# EAGLE design volume control (EAGLE 6.4)
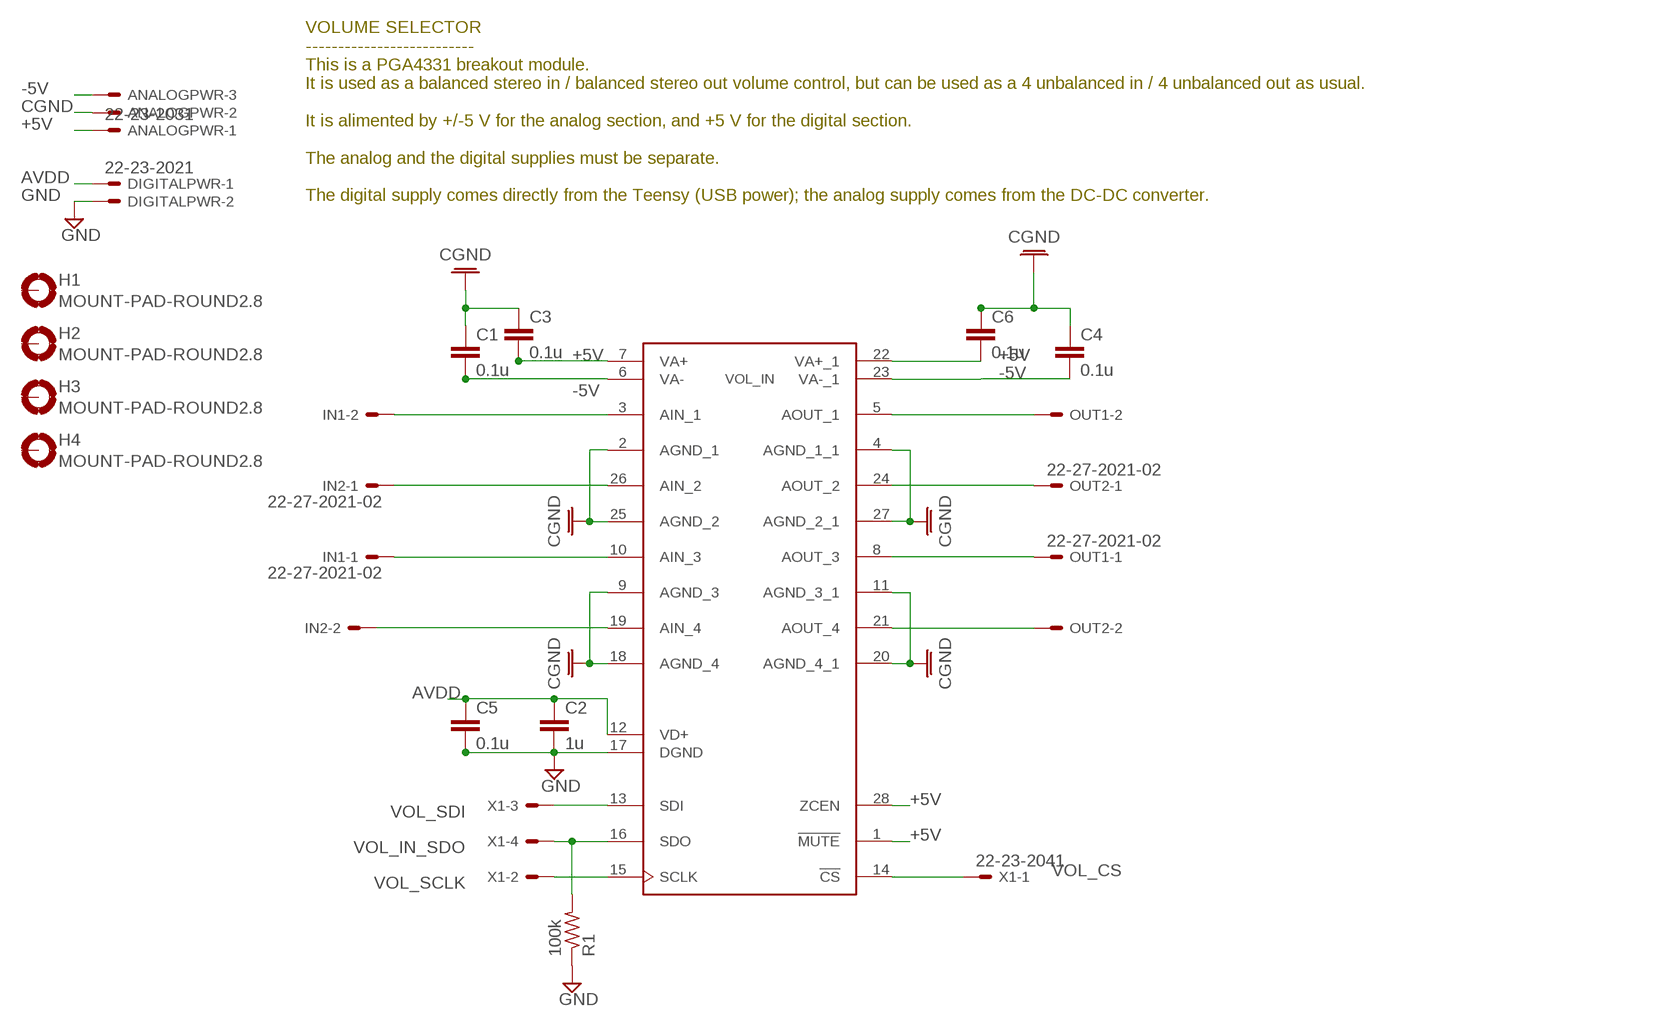
[diagram p0: schematic, sheet 1]

## Parts
ANALOGPWR  22-23-2031  [22-23-2031]
C1  0.1u  C-EUC0603  [C0603]
C2  1u  C-EUC0603  [C0603]
C3  0.1u  C-EUC0603  [C0603]
C4  0.1u  C-EUC0603  [C0603]
C5  0.1u  C-EUC0603  [C0603]
C6  0.1u  C-EUC0603  [C0603]
DIGITALPWR  22-23-2021  [22-23-2021]
H1  MOUNT-PAD-ROUND2.8  [2,8-PAD]
H2  MOUNT-PAD-ROUND2.8  [2,8-PAD]
H3  MOUNT-PAD-ROUND2.8  [2,8-PAD]
H4  MOUNT-PAD-ROUND2.8  [2,8-PAD]
IN1  22-27-2021-02  [6410-02]
IN2  22-27-2021-02  [6410-02]
OUT1  22-27-2021-02  [6410-02]
OUT2  22-27-2021-02  [6410-02]
R1  100k  R-US_R0603  [R0603]
VOL_IN  PGA4311  [DW_R-PDSO_G28]
X1  22-23-2041  [22-23-2041]

## Nets
+5V: ANALOGPWR.1 C3.2 C6.2 VOL_IN.1(!MUTE) VOL_IN.7(VA+) VOL_IN.22(VA+_1) VOL_IN.28(ZCEN)
-5V: ANALOGPWR.3 C1.2 C4.2 VOL_IN.6(VA-) VOL_IN.23(VA-_1)
AVDD: C2.1 C5.1 DIGITALPWR.1 VOL_IN.12(VD+)
CGND: ANALOGPWR.2 C1.1 C3.1 C4.1 C6.1 VOL_IN.2(AGND_1) VOL_IN.4(AGND_1_1) VOL_IN.9(AGND_3) VOL_IN.11(AGND_3_1) VOL_IN.18(AGND_4) VOL_IN.20(AGND_4_1) VOL_IN.25(AGND_2) VOL_IN.27(AGND_2_1)
GND: C2.2 C5.2 DIGITALPWR.2 R1.1 VOL_IN.17(DGND)
N$1: OUT1.1 VOL_IN.8(AOUT_3)
N$2: IN1.2 VOL_IN.3(AIN_1)
N$3: IN1.1 VOL_IN.10(AIN_3)
N$4: OUT2.1 VOL_IN.24(AOUT_2)
N$28: OUT1.2 VOL_IN.5(AOUT_1)
N$47: OUT2.2 VOL_IN.21(AOUT_4)
N$57: IN2.1 VOL_IN.26(AIN_2)
N$80: IN2.2 VOL_IN.19(AIN_4)
VOL_CS: VOL_IN.14(!CS) X1.1
VOL_IN_SDO: R1.2 VOL_IN.16(SDO) X1.4
VOL_SCLK: VOL_IN.15(SCLK) X1.2
VOL_SDI: VOL_IN.13(SDI) X1.3
Unconnected: H1.B2,8(MOUNT) H2.B2,8(MOUNT) H3.B2,8(MOUNT) H4.B2,8(MOUNT)

## Notes on the sheet
- VOLUME SELECTOR
  --------------------------
  This is a PGA4331 breakout module.
  It is used as a balanced stereo in / balanced stereo out volume control, but can be used as a 4 unbalanced in / 4 unbalanced out as usual.
  
  It is alimented by +/-5 V for the analog section, and +5 V for the digital section.
  
  The analog and the digital supplies must be separate.
  
  The digital supply comes directly from the Teensy (USB power); the analog supply comes from the DC-DC converter.

## Library data of the parts
ANALOGPWR = con-molex:22-23-2031: .100" (2.54mm) Center Header - 3 Pin; MF: MOLEX; MPN: 22-23-2031; OC_FARNELL: 1462950; OC_NEWARK: 30C0862
C1-C6 = rcl:C-EU: CAPACITOR, European symbol
DIGITALPWR = con-molex:22-23-2021: .100" (2.54mm) Center Header - 2 Pin; MF: MOLEX; MPN: 22-23-2021; OC_FARNELL: 1462926; OC_NEWARK: 25C3832
H1-H4 = holes:MOUNT-PAD-ROUND: MOUNTING PAD, round
IN1 IN2 OUT1 OUT2 = con-molex:22-?-02: CONNECTOR wire to board 2.54 mm (.1 inch) pitch header; OC_FARNELL: unknown; OC_NEWARK: unknown
R1 = resistor:R-US_: RESISTOR, American symbol
VOL_IN = texas:PGA4311
X1 = con-molex:22-23-2041: .100" (2.54mm) Center Header - 4 Pin; MF: MOLEX; MPN: 22-23-2041; OC_FARNELL: 1462920; OC_NEWARK: 38C0355

## Board
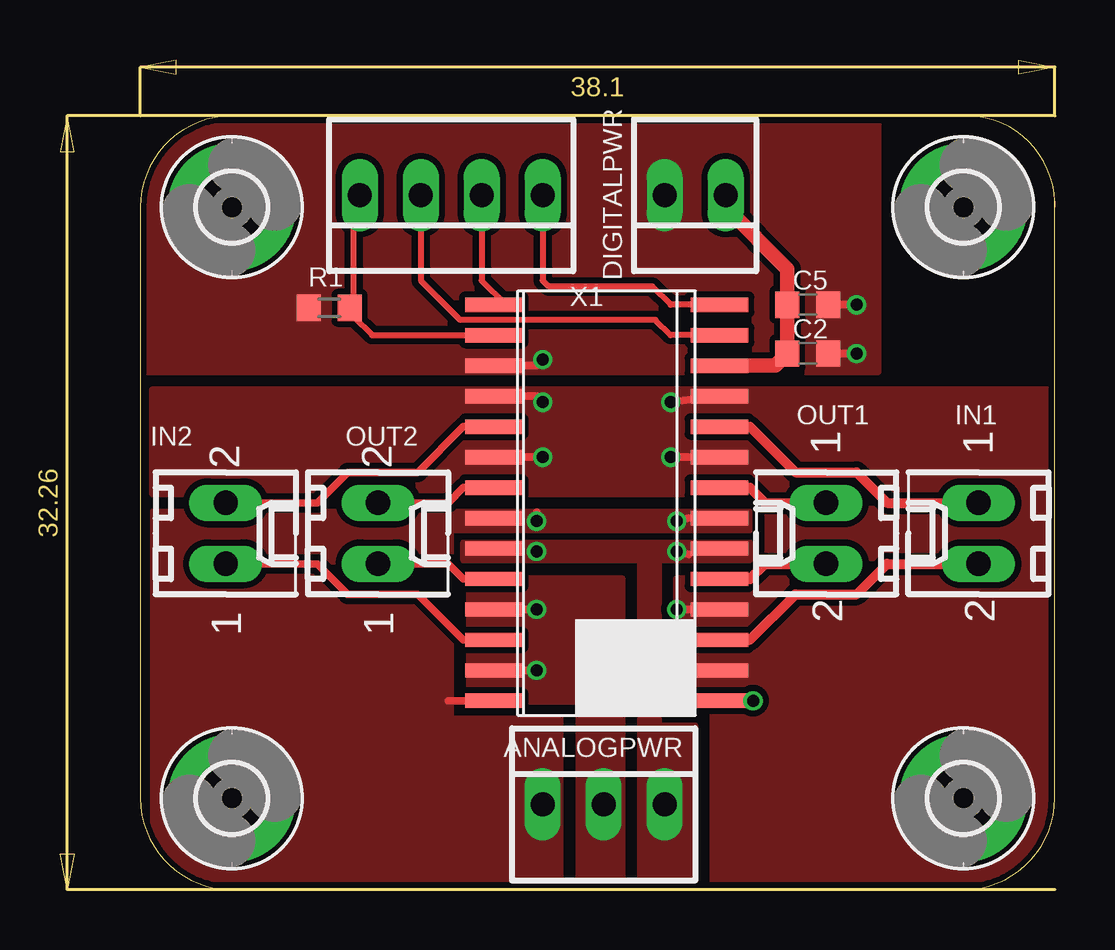
[diagram p1: board, top side]
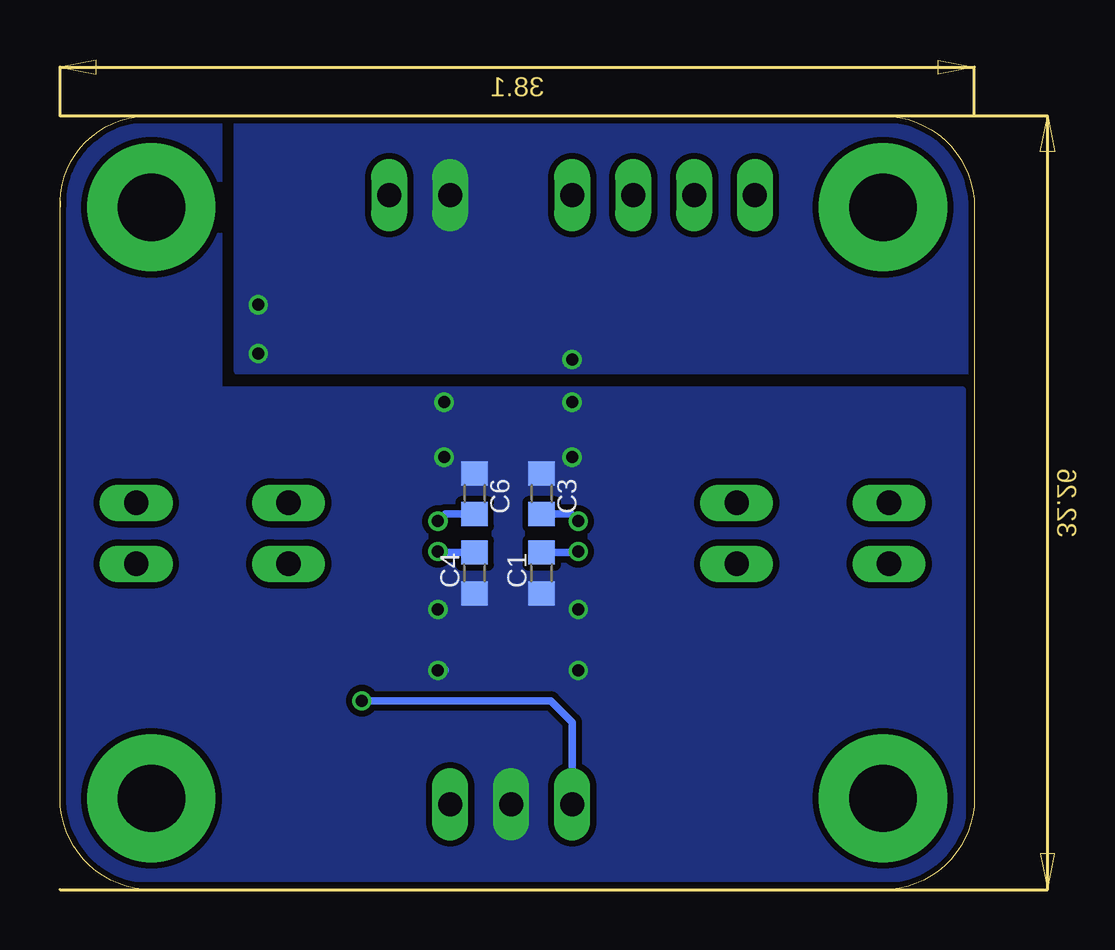
[diagram p2: board, bottom side, seen from below]

Size 38.1 x 32.26 mm. Coordinates in mm from the lower left corner, seen from the top.
Outline: 38.1,28.45 38.1,3.81 arc-90 34.29,0 3.81,0 arc-90 0,3.81 0,28.45 arc-90 3.81,32.26 34.54,32.26 arc-86 38.1,28.7
Outline: 38.1,28.7 38.1,28.45
Outline: 38.1,28.45 arc4 38.1,28.7
Copper layers (1*16): Top 0.035mm / dielectric 1.5mm / Bottom 0.035mm
Design rules "Fusion_eagle_rule_v1.1": minimum track width 6mil, minimum drill 12mil, track to track 6mil, track to pad 6mil, pad to pad 6mil, via to via 6mil, smd to smd 0mil, copper to edge 10mil, drill to drill 10mil, minimum pad ring 10mil, minimum via ring 6mil, stop-mask expansion 2mil, vias tented up to drill 100mil, thermal gap 10mil

### Footprints (pad centres in the part's own frame; a part is rotated, then mirrored left to right if it is on the bottom)
22-23-2031 = drill 1 long: 1 -2.54,0; 2 0,0; 3 2.54,0
C0603 = smd 1 x 1.1: 1 -0.85,0; 2 0.85,0
22-23-2021 = drill 1 long: 1 -1.27,0; 2 1.27,0
2,8-PAD = drill 2.8 pad 5.334: B2,8 0,0
6410-02 = drill 1.016 long: 1 1.27,0; 2 -1.27,0
R0603 = smd 1 x 1.1: 1 -0.85,0; 2 0.85,0
DW_R-PDSO_G28 = smd 0.6 x 2.4: 1 -7.62,-5.08; 2 -6.35,-5.08; 3 -5.08,-5.08; 4 -3.81,-5.08; 5 -2.54,-5.08; 6 -1.27,-5.08; 7 0,-5.08; 8 1.27,-5.08; 9 2.54,-5.08; 10 3.81,-5.08; 11 5.08,-5.08; 12 6.35,-5.08; 13 7.62,-5.08; 14 8.89,-5.08; 15 8.89,4.32; 16 7.62,4.32; 17 6.35,4.32; 18 5.08,4.32; 19 3.81,4.32; 20 2.54,4.32; 21 1.27,4.32; 22 0,4.32; 23 -1.27,4.32; 24 -2.54,4.32; 25 -3.81,4.32; 26 -5.08,4.32; 27 -6.35,4.32; 28 -7.62,4.32
22-23-2041 = drill 1 long: 1 -3.81,0; 2 -1.27,0; 3 1.27,0; 4 3.81,0

### Placement (x,y rotation side)
ANALOGPWR  19.3,3.56 0 top
C1  18.03,13.21 90 bottom
C2  27.81,22.35 0 top
C3  18.03,16.51 270 bottom
C4  20.83,13.21 90 bottom
C5  27.81,24.38 0 top
C6  20.83,16.51 270 bottom
DIGITALPWR  23.11,28.96 180 top
H1  3.81,28.45 0 top
H2  3.81,3.81 0 top
H3  34.29,3.81 0 top
H4  34.29,28.45 0 top
IN1  34.93,14.86 90 top
IN2  3.56,14.86 270 top
OUT1  28.57,14.86 90 top
OUT2  9.91,14.86 270 top
R1  7.87,24.26 0 top
VOL_IN  19.05,15.49 90 top
X1  12.95,28.96 180 top

### Tracks (layer width: path | path; a pad name or v marks a point on that pad's centre or on a via)
+5V  (via drill 0.5)
  Top 0.305: v16.51,15.37 16.51,15.75 | v22.35,15.37 22.86,15.49 | VOL_IN.28 12.83,7.87 | VOL_IN.1 v25.53,7.87
  Bottom 0.305: C3.2 16.8,15.66 v16.51,15.37 | C6.2 22.06,15.66 v22.35,15.37 | v25.53,7.87 17.65,7.87 16.76,6.99 ANALOGPWR.1
  pour Top (isolate 0.254, no thermals): 12.95,14.99 25.4,14.99 25.4,15.75 0.51,15.75 0.51,0 17.53,0 17.53,7.11 12.95,7.11
-5V  (via drill 0.5)
  Top 0.305: v22.35,14.1 22.86,13.97
  Bottom 0.305: C1.2 16.6,14.06 v16.51,14.1 | C4.2 22.26,14.06 v22.35,14.1
  pour Top (isolate 0.254, no thermals): 13.46,14.48 25.4,14.48 25.4,13.72 21.59,13.72 21.59,6.86 23.11,6.86 23.11,0 20.83,0 20.83,13.72 13.46,13.72
AVDD
  Top 0.61: VOL_IN.12 26.46,21.84 C2.1 C5.1 26.96,25.87 24.38,28.45 DIGITALPWR.1
CGND  (via drill 0.5)
  Top 0.305: VOL_IN.25 v16.51,11.68 | VOL_IN.27 v16.51,9.14 | VOL_IN.4 v22.35,11.68 | VOL_IN.20 v16.76,18.03 | VOL_IN.9 v22.1,18.03 | VOL_IN.18 16.51,20.57 v16.76,20.32 | VOL_IN.11 v22.1,20.32
  Top 0.406: VOL_IN.2 v22.35,9.14
  Bottom 0.305: v16.51,11.68 16.76,11.68 | v16.51,9.14 16.76,9.14 | v22.35,11.68 22.1,11.68 | v16.76,20.32 16.76,20.57
  Bottom 0.406: v22.35,9.14 22.1,9.14
  pour Bottom (isolate 0.254, no thermals): 0.51,20.83 0.51,0 38.1,0 38.1,32.26 31.5,32.26 31.5,20.83
  pour Top (isolate 0.254, no thermals): 13.72,7.87 18.29,7.87 18.29,0 20.07,0 20.07,12.95 13.72,12.95
  pour Top (isolate 0.254, no thermals): 0.51,16.51 26.16,16.51 26.16,12.95 22.35,12.95 22.35,7.62 23.88,7.62 23.88,0 38.1,0 38.1,20.83 0.51,20.83
GND  (via drill 0.5)
  Top 0.305: C5.2 v29.84,24.38 | C2.2 v29.84,22.35 | VOL_IN.17 16.51,21.84 v16.76,22.1
  Bottom 0.305: v29.84,24.38 30.1,24.38 | v29.84,22.35 29.59,22.35 | v16.76,22.1 16.76,21.84
  pour Bottom (isolate 0.254, no thermals): 0,32.26 0.25,21.59 30.73,21.59 30.73,32.26
  pour Top (isolate 0.254, no thermals): 0,32.26 0,21.59 30.73,21.59 30.73,32.26
N$1
  Top 0.406: VOL_IN.8 25.4,16.76 26.04,16.13 OUT1.1
N$2
  Top 0.406: VOL_IN.3 25.4,10.41 27.3,12.32 29.84,12.32 31.12,13.59 IN1.2
N$3
  Top 0.406: VOL_IN.10 25.4,19.3 27.3,17.4 29.84,17.4 31.12,16.13 IN1.1
N$4
  Top 0.305: VOL_IN.24 13.46,12.95 12.83,13.59 OUT2.1
N$28
  Top 0.406: VOL_IN.5 25.4,12.95 26.04,13.59 OUT1.2
N$47
  Top 0.305: VOL_IN.21 13.46,16.76 12.83,16.13 OUT2.2
N$57
  Top 0.305: VOL_IN.26 13.46,10.41 11.56,12.32 8.64,12.32 7.37,13.59 IN2.1
N$80
  Top 0.305: VOL_IN.19 13.46,19.3 11.56,17.4 8.64,17.4 7.37,16.13 IN2.2
VOL_CS
  Top 0.254: VOL_IN.14 22.1,24.38 21.34,25.15 17.02,25.15 16.76,25.4 X1.1
VOL_IN_SDO
  Top 0.254: 8.89,24.42 R1.2 8.76,24.26 8.89,24.38 | VOL_IN.16 9.65,23.11 8.89,23.88 8.89,24.38 | 8.89,24.38 8.89,28.7 X1.4
VOL_SCLK
  Top 0.254: VOL_IN.15 15.24,24.38 14.22,25.4 X1.2
VOL_SDI
  Top 0.254: VOL_IN.13 22.1,23.11 21.46,23.75 13.34,23.75 11.68,25.4 X1.3